# Altium schematic sheet Vesc_Bigfets.SchDoc
size C
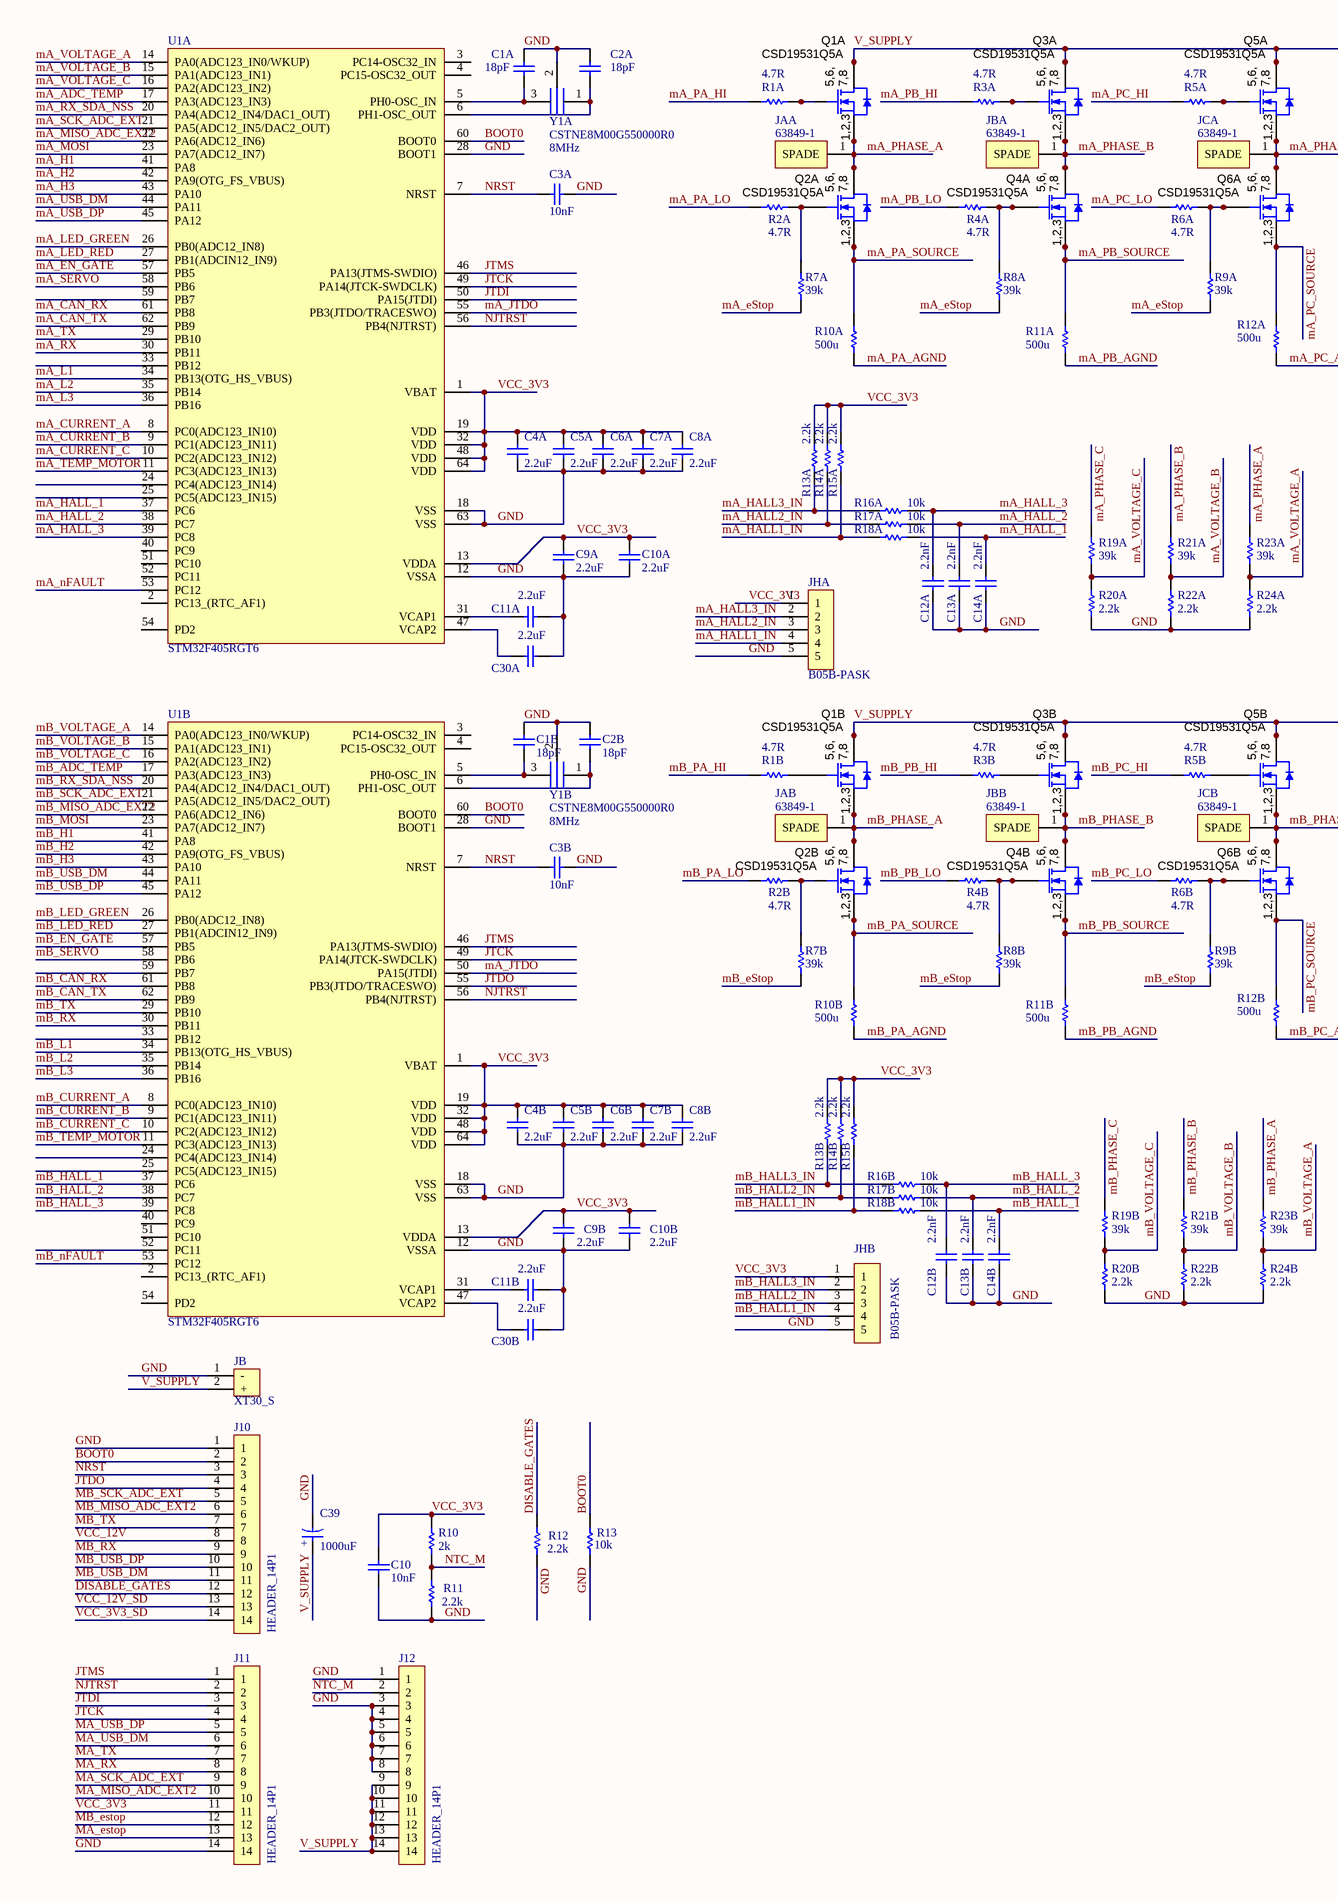
[diagram p0: Vesc_Bigfets.SchDoc, left]
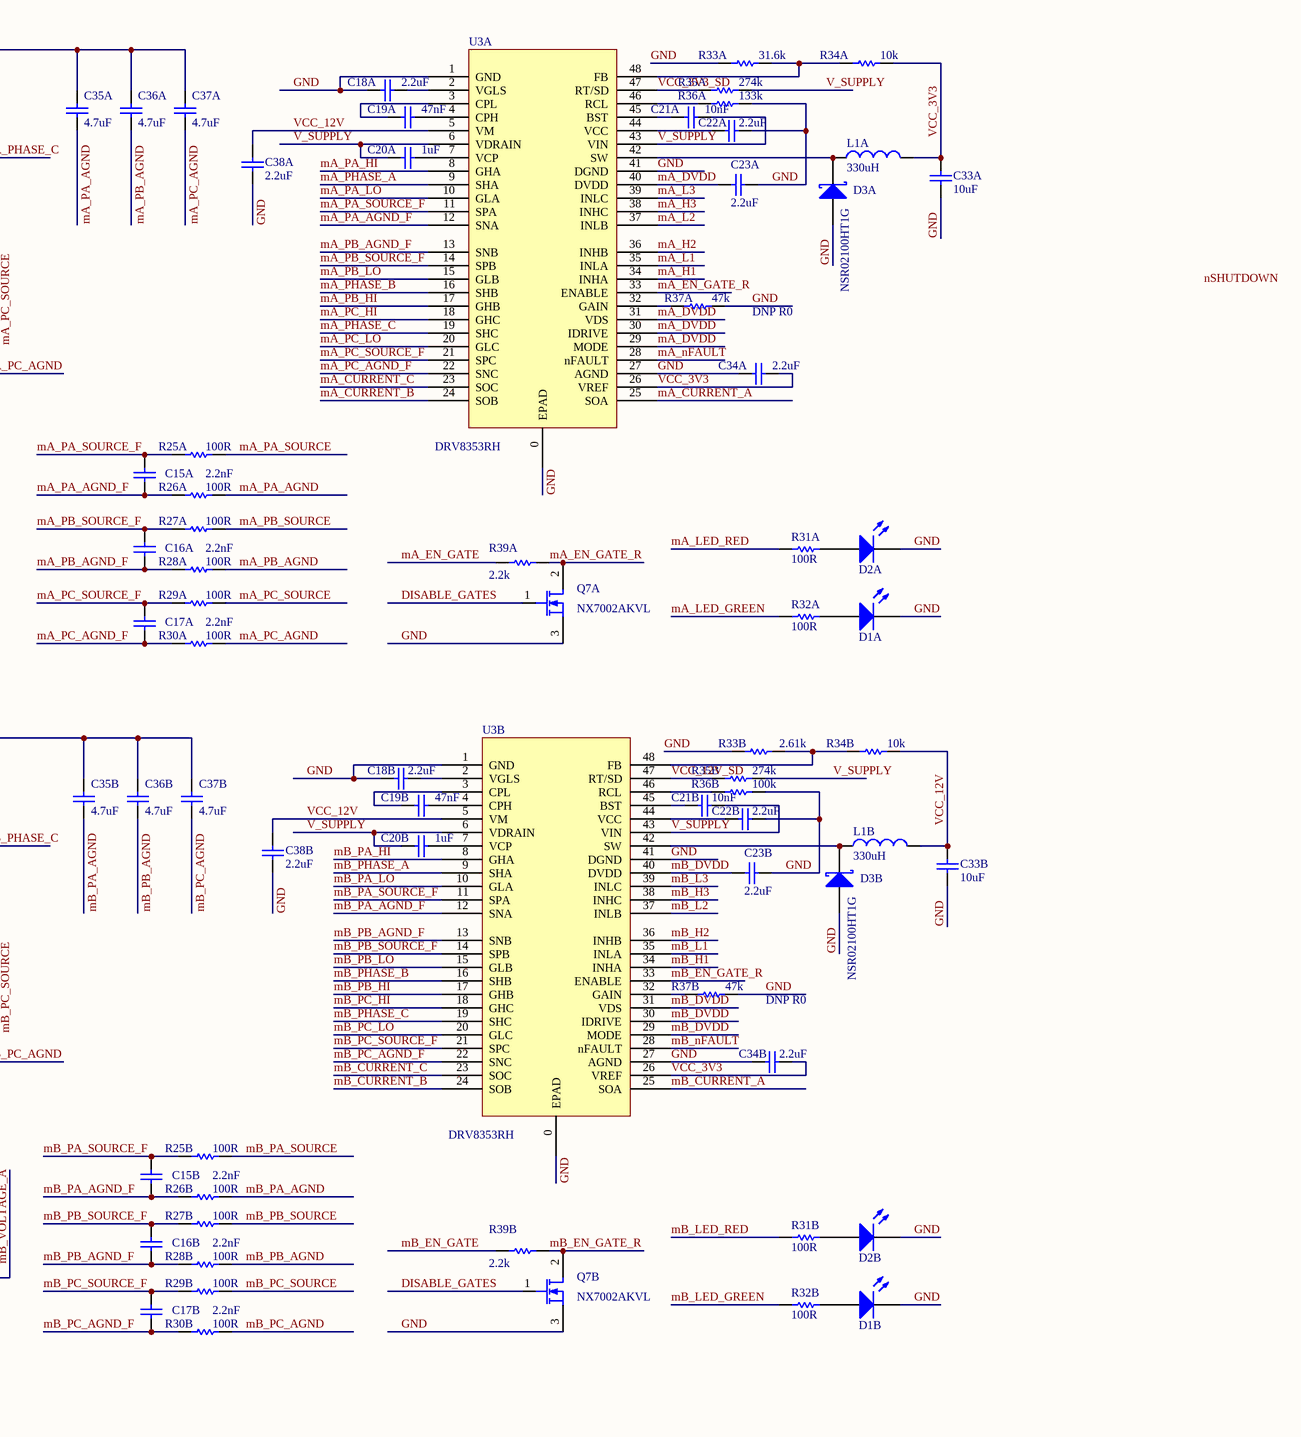
[diagram p1: Vesc_Bigfets.SchDoc, right]

## Parts
C1A  value 18pF  [CAP 0402]  (hidden comment: GCM1555C1H180JA16D)
C1B  value 18pF  [CAP 0402]  (hidden comment: GCM1555C1H180JA16D)
C2A  value 18pF  [CAP 0402]  (hidden comment: GCM1555C1H180JA16D)
C2B  value 18pF  [CAP 0402]  (hidden comment: GCM1555C1H180JA16D)
C3A  value 10nF  [CAP 0402]  (hidden comment: GCM155R71E103JA37D)
C3B  value 10nF  [CAP 0402]  (hidden comment: GCM155R71E103JA37D)
C4A  value 2.2uF  [CAP 0402]  (hidden comment: GRM155C81C225ME15D)
C4B  value 2.2uF  [CAP 0402]  (hidden comment: GRM155C81C225ME15D)
C5A  value 2.2uF  [CAP 0402]  (hidden comment: GRM155C81C225ME15D)
C5B  value 2.2uF  [CAP 0402]  (hidden comment: GRM155C81C225ME15D)
C6A  value 2.2uF  [CAP 0402]  (hidden comment: GRM155C81C225ME15D)
C6B  value 2.2uF  [CAP 0402]  (hidden comment: GRM155C81C225ME15D)
C7A  value 2.2uF  [CAP 0402]  (hidden comment: GRM155C81C225ME15D)
C7B  value 2.2uF  [CAP 0402]  (hidden comment: GRM155C81C225ME15D)
C8A  value 2.2uF  [CAP 0402]  (hidden comment: GRM155C81C225ME15D)
C8B  value 2.2uF  [CAP 0402]  (hidden comment: GRM155C81C225ME15D)
C9A  value 2.2uF  [CAP 0402]  (hidden comment: GRM155C81C225ME15D)
C9B  value 2.2uF  [CAP 0402]  (hidden comment: GRM155C81C225ME15D)
C10  value 10nF  [CAP 0402]  (hidden comment: GCM155R71E103JA37D)
C10A  value 2.2uF  [CAP 0402]  (hidden comment: GRM155C81C225ME15D)
C10B  value 2.2uF  [CAP 0402]  (hidden comment: GRM155C81C225ME15D)
C11A  value 2.2uF  [CAP 0402]  (hidden comment: GRM155C81C225ME15D)
C11B  value 2.2uF  [CAP 0402]  (hidden comment: GRM155C81C225ME15D)
C12A  value 2.2nF  [CAP 0402]  (hidden comment: GCM155R72A222KA37D)
C12B  value 2.2nF  [CAP 0402]  (hidden comment: GCM155R72A222KA37D)
C13A  value 2.2nF  [CAP 0402]  (hidden comment: GCM155R72A222KA37D)
C13B  value 2.2nF  [CAP 0402]  (hidden comment: GCM155R72A222KA37D)
C14A  value 2.2nF  [CAP 0402]  (hidden comment: GCM155R72A222KA37D)
C14B  value 2.2nF  [CAP 0402]  (hidden comment: GCM155R72A222KA37D)
C15A  value 2.2nF  [CAP 0402]  (hidden comment: GCM155R72A222KA37D)
C15B  value 2.2nF  [CAP 0402]  (hidden comment: GCM155R72A222KA37D)
C16A  value 2.2nF  [CAP 0402]  (hidden comment: GCM155R72A222KA37D)
C16B  value 2.2nF  [CAP 0402]  (hidden comment: GCM155R72A222KA37D)
C17A  value 2.2nF  [CAP 0402]  (hidden comment: GCM155R72A222KA37D)
C17B  value 2.2nF  [CAP 0402]  (hidden comment: GCM155R72A222KA37D)
C18A  value 2.2uF  [CAP 0402]  (hidden comment: GRM155C81C225ME15D)
C18B  value 2.2uF  [CAP 0402]  (hidden comment: GRM155C81C225ME15D)
C19A  value 47nF  [CAP 0603]  (hidden comment: C0603C473K1RECAUTO)
C19B  value 47nF  [CAP 0603]  (hidden comment: C0603C473K1RECAUTO)
C20A  value 1uF  [CAP 1206]  (hidden comment: GRJ31CR72A105KE11L)
C20B  value 1uF  [CAP 1206]  (hidden comment: GRJ31CR72A105KE11L)
C21A  value 10nF  [CAP 0402]  (hidden comment: GCM155R71E103JA37D)
C21B  value 10nF  [CAP 0402]  (hidden comment: GCM155R71E103JA37D)
C22A  value 2.2uF  [CAP 0402]  (hidden comment: GRM155C81C225ME15D)
C22B  value 2.2uF  [CAP 0402]  (hidden comment: GRM155C81C225ME15D)
C23A  value 2.2uF  [CAP 0402]  (hidden comment: GRM155C81C225ME15D)
C23B  value 2.2uF  [CAP 0402]  (hidden comment: GRM155C81C225ME15D)
C30A  value 2.2uF  [CAP 0402]  (hidden comment: GRM155C81C225ME15D)
C30B  value 2.2uF  [CAP 0402]  (hidden comment: GRM155C81C225ME15D)
C33A  value 10uF  [CAP 1206]  (hidden comment: TMK316AB7106KL-T)
C33B  value 10uF  [CAP 1206]  (hidden comment: TMK316AB7106KL-T)
C34A  value 2.2uF  [CAP 0402]  (hidden comment: GRM155C81C225ME15D)
C34B  value 2.2uF  [CAP 0402]  (hidden comment: GRM155C81C225ME15D)
C35A  value 4.7uF  [CAP 1210]  (hidden comment: CGA6M3X7S2A475M200AB)
C35B  value 4.7uF  [CAP 1210]  (hidden comment: CGA6M3X7S2A475M200AB)
C36A  value 4.7uF  [CAP 1210]  (hidden comment: CGA6M3X7S2A475M200AB)
C36B  value 4.7uF  [CAP 1210]  (hidden comment: CGA6M3X7S2A475M200AB)
C37A  value 4.7uF  [CAP 1210]  (hidden comment: CGA6M3X7S2A475M200AB)
C37B  value 4.7uF  [CAP 1210]  (hidden comment: CGA6M3X7S2A475M200AB)
C38A  value 2.2uF  [CAP 0402]  (hidden comment: GRM155C81C225ME15D)
C38B  value 2.2uF  [CAP 0402]  (hidden comment: GRM155C81C225ME15D)
C39  value 1000uF  [CAP 7.5mm Bent Reverse]  (hidden comment: 108CKS100MRY)
D1A  LTST-C190KRKT  [LED 0603]  (value not drawn)
D1B  LTST-C190KRKT  [LED 0603]  (value not drawn)
D2A  LTST-C190KRKT  [LED 0603]  (value not drawn)
D2B  LTST-C190KRKT  [LED 0603]  (value not drawn)
D3A  NSR02100HT1G  [SOD-323/SC76]
D3B  NSR02100HT1G  [SOD-323/SC76]
J10  HEADER_14P1  [HEADER_14P1_FEMALE_TH]
J11  HEADER_14P1  [HEADER_14P1_FEMALE_TH]
J12  HEADER_14P1  [HEADER_14P1_FEMALE_TH]
JAA  63849-1  [63849-1]
JAB  63849-1  [63849-1]
JB  XT30_S  [XT30 SOCKET]
JBA  63849-1  [63849-1]
JBB  63849-1  [63849-1]
JCA  63849-1  [63849-1]
JCB  63849-1  [63849-1]
JHA  B05B-PASK  [B05B-PASK]
JHB  B05B-PASK  [B05B-PASK]
L1A  value 330uH  [SDE0805A]  (hidden comment: SDE0805A-331K)
L1B  value 330uH  [SDE0805A]  (hidden comment: SDE0805A-331K)
Q1A  CSD19531Q5A  [VSONP-8]
Q1B  CSD19531Q5A  [VSONP-8]
Q2A  CSD19531Q5A  [VSONP-8]
Q2B  CSD19531Q5A  [VSONP-8]
Q3A  CSD19531Q5A  [VSONP-8]
Q3B  CSD19531Q5A  [VSONP-8]
Q4A  CSD19531Q5A  [VSONP-8]
Q4B  CSD19531Q5A  [VSONP-8]
Q5A  CSD19531Q5A  [VSONP-8]
Q5B  CSD19531Q5A  [VSONP-8]
Q6A  CSD19531Q5A  [VSONP-8]
Q6B  CSD19531Q5A  [VSONP-8]
Q7A  NX7002AKVL  [SOT-23-3]
Q7B  NX7002AKVL  [SOT-23-3]
R1A  value 4.7R  [RES 0402]  (hidden comment: ERJ-PA3J4R7V)
R1B  value 4.7R  [RES 0402]  (hidden comment: ERJ-PA3J4R7V)
R2A  value 4.7R  [RES 0402]  (hidden comment: ERJ-PA3J4R7V)
R2B  value 4.7R  [RES 0402]  (hidden comment: ERJ-PA3J4R7V)
R3A  value 4.7R  [RES 0402]  (hidden comment: ERJ-PA3J4R7V)
R3B  value 4.7R  [RES 0402]  (hidden comment: ERJ-PA3J4R7V)
R4A  value 4.7R  [RES 0402]  (hidden comment: ERJ-PA3J4R7V)
R4B  value 4.7R  [RES 0402]  (hidden comment: ERJ-PA3J4R7V)
R5A  value 4.7R  [RES 0402]  (hidden comment: ERJ-PA3J4R7V)
R5B  value 4.7R  [RES 0402]  (hidden comment: ERJ-PA3J4R7V)
R6A  value 4.7R  [RES 0402]  (hidden comment: ERJ-PA3J4R7V)
R6B  value 4.7R  [RES 0402]  (hidden comment: ERJ-PA3J4R7V)
R7A  value 39k  [RES 0402]  (hidden comment: ERJ-2RKF3902X)
R7B  value 39k  [RES 0402]  (hidden comment: ERJ-2RKF3902X)
R8A  value 39k  [RES 0402]  (hidden comment: ERJ-2RKF3902X)
R8B  value 39k  [RES 0402]  (hidden comment: ERJ-2RKF3902X)
R9A  value 39k  [RES 0402]  (hidden comment: ERJ-2RKF3902X)
R9B  value 39k  [RES 0402]  (hidden comment: ERJ-2RKF3902X)
R10  value 2k  [RES 0402]  (hidden comment: ERT-J0EG202GM)
R10A  value 500u  [RES 2512]  (hidden comment: WSLF2512L5000FEA)
R10B  value 500u  [RES 2512]  (hidden comment: WSLF2512L5000FEA)
R11  value 2.2k  [RES 0402]  (hidden comment: ERJ-2RKF2201X)
R11A  value 500u  [RES 2512]  (hidden comment: WSLF2512L5000FEA)
R11B  value 500u  [RES 2512]  (hidden comment: WSLF2512L5000FEA)
R12  value 2.2k  [RES 0402]  (hidden comment: ERJ-2RKF2201X)
R12A  value 500u  [RES 2512]  (hidden comment: WSLF2512L5000FEA)
R12B  value 500u  [RES 2512]  (hidden comment: WSLF2512L5000FEA)
R13  value 10k  [RES 0402]  (hidden comment: ERJ-2RKF1002X)
R13A  value 2.2k  [RES 0402]  (hidden comment: ERJ-2RKF2201X)
R13B  value 2.2k  [RES 0402]  (hidden comment: ERJ-2RKF2201X)
R14A  value 2.2k  [RES 0402]  (hidden comment: ERJ-2RKF2201X)
R14B  value 2.2k  [RES 0402]  (hidden comment: ERJ-2RKF2201X)
R15A  value 2.2k  [RES 0402]  (hidden comment: ERJ-2RKF2201X)
R15B  value 2.2k  [RES 0402]  (hidden comment: ERJ-2RKF2201X)
R16A  value 10k  [RES 0402]  (hidden comment: ERJ-2RKF1002X)
R16B  value 10k  [RES 0402]  (hidden comment: ERJ-2RKF1002X)
R17A  value 10k  [RES 0402]  (hidden comment: ERJ-2RKF1002X)
R17B  value 10k  [RES 0402]  (hidden comment: ERJ-2RKF1002X)
R18A  value 10k  [RES 0402]  (hidden comment: ERJ-2RKF1002X)
R18B  value 10k  [RES 0402]  (hidden comment: ERJ-2RKF1002X)
R19A  value 39k  [RES 0402]  (hidden comment: ERJ-2RKF3902X)
R19B  value 39k  [RES 0402]  (hidden comment: ERJ-2RKF3902X)
R20A  value 2.2k  [RES 0402]  (hidden comment: ERJ-2RKF2201X)
R20B  value 2.2k  [RES 0402]  (hidden comment: ERJ-2RKF2201X)
R21A  value 39k  [RES 0402]  (hidden comment: ERJ-2RKF3902X)
R21B  value 39k  [RES 0402]  (hidden comment: ERJ-2RKF3902X)
R22A  value 2.2k  [RES 0402]  (hidden comment: ERJ-2RKF2201X)
R22B  value 2.2k  [RES 0402]  (hidden comment: ERJ-2RKF2201X)
R23A  value 39k  [RES 0402]  (hidden comment: ERJ-2RKF3902X)
R23B  value 39k  [RES 0402]  (hidden comment: ERJ-2RKF3902X)
R24A  value 2.2k  [RES 0402]  (hidden comment: ERJ-2RKF2201X)
R24B  value 2.2k  [RES 0402]  (hidden comment: ERJ-2RKF2201X)
R25A  value 100R  [RES 0402]  (hidden comment: ERJ-2RKF1000X)
R25B  value 100R  [RES 0402]  (hidden comment: ERJ-2RKF1000X)
R26A  value 100R  [RES 0402]  (hidden comment: ERJ-2RKF1000X)
R26B  value 100R  [RES 0402]  (hidden comment: ERJ-2RKF1000X)
R27A  value 100R  [RES 0402]  (hidden comment: ERJ-2RKF1000X)
R27B  value 100R  [RES 0402]  (hidden comment: ERJ-2RKF1000X)
R28A  value 100R  [RES 0402]  (hidden comment: ERJ-2RKF1000X)
R28B  value 100R  [RES 0402]  (hidden comment: ERJ-2RKF1000X)
R29A  value 100R  [RES 0402]  (hidden comment: ERJ-2RKF1000X)
R29B  value 100R  [RES 0402]  (hidden comment: ERJ-2RKF1000X)
R30A  value 100R  [RES 0402]  (hidden comment: ERJ-2RKF1000X)
R30B  value 100R  [RES 0402]  (hidden comment: ERJ-2RKF1000X)
R31A  value 100R  [RES 0402]  (hidden comment: ERJ-2RKF1000X)
R31B  value 100R  [RES 0402]  (hidden comment: ERJ-2RKF1000X)
R32A  value 100R  [RES 0402]  (hidden comment: ERJ-2RKF1000X)
R32B  value 100R  [RES 0402]  (hidden comment: ERJ-2RKF1000X)
R33A  value 31.6k  [RES 0402]  (hidden comment: ERJ-2RKF3162X)
R33B  value 2.61k  [RES 0402]  (hidden comment: ERJ-2RKF2611X)
R34A  value 10k  [RES 0402]  (hidden comment: ERJ-2RKF1002X)
R34B  value 10k  [RES 0402]  (hidden comment: ERJ-2RKF1002X)
R35A  value 274k  [RES 0402]  (hidden comment: ERJ-2RKF2743X)
R35B  value 274k  [RES 0402]  (hidden comment: ERJ-2RKF2743X)
R36A  value 133k  [RES 0402]  (hidden comment: ERJ-2RKF1333X)
R36B  value 100k  [RES 0402]  (hidden comment: ERJ-2RKF1003X)
R37A  value 47k  [RES 0402]  (hidden comment: ERJ-2RKF4702X)
R37B  value 47k  [RES 0402]  (hidden comment: ERJ-2RKF4702X)
R39A  value 2.2k  [RES 0402]  (hidden comment: ERJ-2RKF2201X)
R39B  value 2.2k  [RES 0402]  (hidden comment: ERJ-2RKF2201X)
U1A  STM32F405RGT6  [QFP-64 - P0.5MM]
U1B  STM32F405RGT6  [QFP-64 - P0.5MM]
U3A  DRV8353RH  [QFN-48 - P0.5MM]
U3B  DRV8353RH  [QFN-48 - P0.5MM]
Y1A  CSTNE8M00G550000R0  value 8MHz  [MuRata CSTN]
Y1B  CSTNE8M00G550000R0  value 8MHz  [MuRata CSTN]

## Nets
BOOT0: J10.2 R13.2 U1A.60(BOOT0) U1B.60(BOOT0)
DISABLE_GATES: J10.12 Q7A.1(G) Q7B.1(G) R12.2
GND: C1A.2 C1B.2 C2A.2 C2B.2 C3A.2 C3B.2 C4A.2 C4B.2 C5A.2 C5B.2 C6A.2 C6B.2 C7A.2 C7B.2 C8A.2 C8B.2 C9A.2 C9B.2 C10.1 C10A.2 C10B.2 C11A.2 C11B.2 C12A.1 C12B.1 C13A.1 C13B.1 C14A.1 C14B.1 C18A.2 C18B.2 C22A.1 C22B.1 C23A.1 C23B.1 C30A.2 C30B.2 C33A.2 C33B.2 C34A.2 C34B.2 C38A.2 C38B.2 C39.1 D1A.2(K) D1B.2(K) D2A.2(K) D2B.2(K) D3A.1(A) D3B.1(A) J10.1 J11.14 J12.1 J12.3 J12.4 J12.5 J12.6 J12.7 J12.8 JB.1(-) JHA.5 JHB.5 Q7A.3(D) Q7B.3(D) R11.1 R12.1 R13.1 R20A.1 R20B.1 R22A.1 R22B.1 R24A.1 R24B.1 R33A.1 R33B.1 R36A.2 R36B.2 R37A.2 R37B.2 U1A.12(VSSA) U1A.18(VSS) U1A.28(BOOT1) U1A.63(VSS) U1B.12(VSSA) U1B.18(VSS) U1B.28(BOOT1) U1B.63(VSS) U3A.0(EPAD) U3A.1(GND) U3A.27(AGND) U3A.41(DGND) U3B.0(EPAD) U3B.1(GND) U3B.27(AGND) U3B.41(DGND) Y1A.2 Y1B.2
JTCK: J11.4 U1A.49(PA14(JTCK-SWDCLK)) U1B.49(PA14(JTCK-SWDCLK))
JTDI: J11.3 U1A.50(PA15(JTDI))
JTDO: J10.4 U1B.55(PB3(JTDO/TRACESWO))
JTMS: J11.1 U1A.46(PA13(JTMS-SWDIO)) U1B.46(PA13(JTMS-SWDIO))
mA_ADC_TEMP: U1A.17(PA3(ADC123_IN3))
mA_CAN_RX: U1A.61(PB8)
mA_CAN_TX: U1A.62(PB9)
mA_CURRENT_A: U1A.8(PC0(ADC123_IN10)) U3A.25(SOA)
mA_CURRENT_B: U1A.9(PC1(ADC123_IN11)) U3A.24(SOB)
mA_CURRENT_C: U1A.10(PC2(ADC123_IN12)) U3A.23(SOC)
mA_DVDD: C23A.2 U3A.29(MODE) U3A.30(IDRIVE) U3A.31(VDS) U3A.40(DVDD)
mA_EN_GATE: R39A.2 U1A.57(PB5)
mA_EN_GATE_R: Q7A.2(S) R39A.1 U3A.33(ENABLE)
mA_eStop: J11.13 R7A.1 R8A.1 R9A.1
mA_H1: U1A.41(PA8) U3A.34(INHA)
mA_H2: U1A.42(PA9(OTG_FS_VBUS)) U3A.36(INHB)
mA_H3: U1A.43(PA10) U3A.38(INHC)
mA_HALL1_IN: JHA.4 R15A.1 R18A.1
mA_HALL2_IN: JHA.3 R14A.1 R17A.1
mA_HALL3_IN: JHA.2 R13A.1 R16A.1
mA_HALL_1: C14A.2 R18A.2 U1A.37(PC6)
mA_HALL_2: C13A.2 R17A.2 U1A.38(PC7)
mA_HALL_3: C12A.2 R16A.2 U1A.39(PC8)
mA_JTDO: U1A.55(PB3(JTDO/TRACESWO)) U1B.50(PA15(JTDI))
mA_L1: U1A.34(PB13(OTG_HS_VBUS)) U3A.35(INLA)
mA_L2: U1A.35(PB14) U3A.37(INLB)
mA_L3: U1A.36(PB16) U3A.39(INLC)
mA_LED_GREEN: R32A.2 U1A.26(PB0(ADC12_IN8))
mA_LED_RED: R31A.2 U1A.27(PB1(ADCIN12_IN9))
mA_MISO_ADC_EXT2: J11.10 U1A.22(PA6(ADC12_IN6))
mA_MOSI: U1A.23(PA7(ADC12_IN7))
mA_nFAULT: U1A.53(PC12) U3A.28(nFAULT)
mA_PA_AGND: C35A.1 R10A.1 R26A.2
mA_PA_AGND_F: C15A.1 R26A.1 U3A.12(SNA)
mA_PA_HI: R1A.1 U3A.8(GHA)
mA_PA_LO: R2A.1 U3A.10(GLA)
mA_PA_SOURCE: Q2A.1(S) Q2A.2(S) Q2A.3(S) R10A.2 R25A.2
mA_PA_SOURCE_F: C15A.2 R25A.1 U3A.11(SPA)
mA_PB_AGND: C36A.1 R11A.1 R28A.2
mA_PB_AGND_F: C16A.1 R28A.1 U3A.13(SNB)
mA_PB_HI: R3A.1 U3A.17(GHB)
mA_PB_LO: R4A.1 U3A.15(GLB)
mA_PB_SOURCE: Q4A.1(S) Q4A.2(S) Q4A.3(S) R11A.2 R27A.2
mA_PB_SOURCE_F: C16A.2 R27A.1 U3A.14(SPB)
mA_PC_AGND: C37A.1 R12A.1 R30A.2
mA_PC_AGND_F: C17A.1 R30A.1 U3A.22(SNC)
mA_PC_HI: R5A.1 U3A.18(GHC)
mA_PC_LO: R6A.1 U3A.20(GLC)
mA_PC_SOURCE: Q6A.1(S) Q6A.2(S) Q6A.3(S) R12A.2 R29A.2
mA_PC_SOURCE_F: C17A.2 R29A.1 U3A.21(SPC)
mA_PHASE_A: JAA.1(SPADE) Q1A.1(S) Q1A.2(S) Q1A.3(S) Q2A.5(D) Q2A.6(D) Q2A.7(D) Q2A.8(D) Q2A.9(D) R23A.2 U3A.9(SHA)
mA_PHASE_B: JBA.1(SPADE) Q3A.1(S) Q3A.2(S) Q3A.3(S) Q4A.5(D) Q4A.6(D) Q4A.7(D) Q4A.8(D) Q4A.9(D) R21A.2 U3A.16(SHB)
mA_PHASE_C: JCA.1(SPADE) Q5A.1(S) Q5A.2(S) Q5A.3(S) Q6A.5(D) Q6A.6(D) Q6A.7(D) Q6A.8(D) Q6A.9(D) R19A.2 U3A.19(SHC)
mA_RX: J11.8 U1A.30(PB11)
mA_RX_SDA_NSS: U1A.20(PA4(ADC12_IN4/DAC1_OUT))
mA_SCK_ADC_EXT: J11.9 U1A.21(PA5(ADC12_IN5/DAC2_OUT))
mA_SERVO: U1A.58(PB6)
mA_TEMP_MOTOR: U1A.11(PC3(ADC123_IN13))
mA_TX: J11.7 U1A.29(PB10)
mA_USB_DM: J11.6 U1A.44(PA11)
mA_USB_DP: J11.5 U1A.45(PA12)
mA_VOLTAGE_A: R23A.1 R24A.2 U1A.14(PA0(ADC123_IN0/WKUP))
mA_VOLTAGE_B: R21A.1 R22A.2 U1A.15(PA1(ADC123_IN1))
mA_VOLTAGE_C: R19A.1 R20A.2 U1A.16(PA2(ADC123_IN2))
mB_ADC_TEMP: U1B.17(PA3(ADC123_IN3))
mB_CAN_RX: U1B.61(PB8)
mB_CAN_TX: U1B.62(PB9)
mB_CURRENT_A: U1B.8(PC0(ADC123_IN10)) U3B.25(SOA)
mB_CURRENT_B: U1B.9(PC1(ADC123_IN11)) U3B.24(SOB)
mB_CURRENT_C: U1B.10(PC2(ADC123_IN12)) U3B.23(SOC)
mB_DVDD: C23B.2 U3B.29(MODE) U3B.30(IDRIVE) U3B.31(VDS) U3B.40(DVDD)
mB_EN_GATE: R39B.2 U1B.57(PB5)
mB_EN_GATE_R: Q7B.2(S) R39B.1 U3B.33(ENABLE)
mB_eStop: J11.12 R7B.1 R8B.1 R9B.1
mB_H1: U1B.41(PA8) U3B.34(INHA)
mB_H2: U1B.42(PA9(OTG_FS_VBUS)) U3B.36(INHB)
mB_H3: U1B.43(PA10) U3B.38(INHC)
mB_HALL1_IN: JHB.4 R15B.1 R18B.1
mB_HALL2_IN: JHB.3 R14B.1 R17B.1
mB_HALL3_IN: JHB.2 R13B.1 R16B.1
mB_HALL_1: C14B.2 R18B.2 U1B.37(PC6)
mB_HALL_2: C13B.2 R17B.2 U1B.38(PC7)
mB_HALL_3: C12B.2 R16B.2 U1B.39(PC8)
mB_L1: U1B.34(PB13(OTG_HS_VBUS)) U3B.35(INLA)
mB_L2: U1B.35(PB14) U3B.37(INLB)
mB_L3: U1B.36(PB16) U3B.39(INLC)
mB_LED_GREEN: R32B.2 U1B.26(PB0(ADC12_IN8))
mB_LED_RED: R31B.2 U1B.27(PB1(ADCIN12_IN9))
mB_MISO_ADC_EXT2: J10.6 U1B.22(PA6(ADC12_IN6))
mB_MOSI: U1B.23(PA7(ADC12_IN7))
mB_nFAULT: U1B.53(PC12) U3B.28(nFAULT)
mB_PA_AGND: C35B.1 R10B.1 R26B.2
mB_PA_AGND_F: C15B.1 R26B.1 U3B.12(SNA)
mB_PA_HI: R1B.1 U3B.8(GHA)
mB_PA_LO: R2B.1 U3B.10(GLA)
mB_PA_SOURCE: Q2B.1(S) Q2B.2(S) Q2B.3(S) R10B.2 R25B.2
mB_PA_SOURCE_F: C15B.2 R25B.1 U3B.11(SPA)
mB_PB_AGND: C36B.1 R11B.1 R28B.2
mB_PB_AGND_F: C16B.1 R28B.1 U3B.13(SNB)
mB_PB_HI: R3B.1 U3B.17(GHB)
mB_PB_LO: R4B.1 U3B.15(GLB)
mB_PB_SOURCE: Q4B.1(S) Q4B.2(S) Q4B.3(S) R11B.2 R27B.2
mB_PB_SOURCE_F: C16B.2 R27B.1 U3B.14(SPB)
mB_PC_AGND: C37B.1 R12B.1 R30B.2
mB_PC_AGND_F: C17B.1 R30B.1 U3B.22(SNC)
mB_PC_HI: R5B.1 U3B.18(GHC)
mB_PC_LO: R6B.1 U3B.20(GLC)
mB_PC_SOURCE: Q6B.1(S) Q6B.2(S) Q6B.3(S) R12B.2 R29B.2
mB_PC_SOURCE_F: C17B.2 R29B.1 U3B.21(SPC)
mB_PHASE_A: JAB.1(SPADE) Q1B.1(S) Q1B.2(S) Q1B.3(S) Q2B.5(D) Q2B.6(D) Q2B.7(D) Q2B.8(D) Q2B.9(D) R23B.2 U3B.9(SHA)
mB_PHASE_B: JBB.1(SPADE) Q3B.1(S) Q3B.2(S) Q3B.3(S) Q4B.5(D) Q4B.6(D) Q4B.7(D) Q4B.8(D) Q4B.9(D) R21B.2 U3B.16(SHB)
mB_PHASE_C: JCB.1(SPADE) Q5B.1(S) Q5B.2(S) Q5B.3(S) Q6B.5(D) Q6B.6(D) Q6B.7(D) Q6B.8(D) Q6B.9(D) R19B.2 U3B.19(SHC)
mB_RX: J10.9 U1B.30(PB11)
mB_RX_SDA_NSS: U1B.20(PA4(ADC12_IN4/DAC1_OUT))
mB_SCK_ADC_EXT: J10.5 U1B.21(PA5(ADC12_IN5/DAC2_OUT))
mB_SERVO: U1B.58(PB6)
mB_TEMP_MOTOR: U1B.11(PC3(ADC123_IN13))
mB_TX: J10.7 U1B.29(PB10)
mB_USB_DM: J10.11 U1B.44(PA11)
mB_USB_DP: J10.10 U1B.45(PA12)
mB_VOLTAGE_A: R23B.1 R24B.2 U1B.14(PA0(ADC123_IN0/WKUP))
mB_VOLTAGE_B: R21B.1 R22B.2 U1B.15(PA1(ADC123_IN1))
mB_VOLTAGE_C: R19B.1 R20B.2 U1B.16(PA2(ADC123_IN2))
NJTRST: J11.2 U1A.56(PB4(NJTRST)) U1B.56(PB4(NJTRST))
NRST: C3A.1 C3B.1 J10.3 U1A.7(NRST) U1B.7(NRST)
NTC_M: J12.2 R10.1 R11.2
V_SUPPLY: C20A.1 C20B.1 C21A.2 C21B.2 C35A.2 C35B.2 C36A.2 C36B.2 C37A.2 C37B.2 C39.2 J12.9 J12.10 J12.11 J12.12 J12.13 J12.14 JB.2(+) Q1A.5(D) Q1A.6(D) Q1A.7(D) Q1A.8(D) Q1A.9(D) Q1B.5(D) Q1B.6(D) Q1B.7(D) Q1B.8(D) Q1B.9(D) Q3A.5(D) Q3A.6(D) Q3A.7(D) Q3A.8(D) Q3A.9(D) Q3B.5(D) Q3B.6(D) Q3B.7(D) Q3B.8(D) Q3B.9(D) Q5A.5(D) Q5A.6(D) Q5A.7(D) Q5A.8(D) Q5A.9(D) Q5B.5(D) Q5B.6(D) Q5B.7(D) Q5B.8(D) Q5B.9(D) R35A.2 R35B.2 U3A.6(VDRAIN) U3A.43(VIN) U3B.6(VDRAIN) U3B.43(VIN)
VCC_3V3: C4A.1 C4B.1 C5A.1 C5B.1 C6A.1 C6B.1 C7A.1 C7B.1 C8A.1 C8B.1 C9A.1 C9B.1 C10.2 C10A.1 C10B.1 C33A.1 C34A.1 C34B.1 J11.11 JHA.1 JHB.1 L1A.2 R10.2 R13A.2 R13B.2 R14A.2 R14B.2 R15A.2 R15B.2 R34A.2 U1A.1(VBAT) U1A.13(VDDA) U1A.19(VDD) U1A.32(VDD) U1A.48(VDD) U1A.64(VDD) U1B.1(VBAT) U1B.13(VDDA) U1B.19(VDD) U1B.32(VDD) U1B.48(VDD) U1B.64(VDD) U3A.26(VREF) U3B.26(VREF)
VCC_3V3_SD: J10.14 R35A.1 U3A.47(RT/SD)
VCC_12V: C33B.1 C38A.1 C38B.1 J10.8 L1B.2 R34B.2 U3A.5(VM) U3B.5(VM)
VCC_12V_SD: J10.13 R35B.1 U3B.47(RT/SD)
NetC1A_1: C1A.1 U1A.5(PH0-OSC_IN) Y1A.3
NetC1B_1: C1B.1 U1B.5(PH0-OSC_IN) Y1B.3
NetC2A_1: C2A.1 U1A.6(PH1-OSC_OUT) Y1A.1
NetC2B_1: C2B.1 U1B.6(PH1-OSC_OUT) Y1B.1
NetC11A_1: C11A.1 U1A.31(VCAP1)
NetC11B_1: C11B.1 U1B.31(VCAP1)
NetC18A_1: C18A.1 U3A.2(VGLS)
NetC18B_1: C18B.1 U3B.2(VGLS)
NetC19A_1: C19A.1 U3A.3(CPL)
NetC19A_2: C19A.2 U3A.4(CPH)
NetC19B_1: C19B.1 U3B.3(CPL)
NetC19B_2: C19B.2 U3B.4(CPH)
NetC20A_2: C20A.2 U3A.7(VCP)
NetC20B_2: C20B.2 U3B.7(VCP)
NetC21A_1: C21A.1 U3A.45(BST)
NetC21B_1: C21B.1 U3B.45(BST)
NetC22A_2: C22A.2 U3A.44(VCC)
NetC22B_2: C22B.2 U3B.44(VCC)
NetC30A_1: C30A.1 U1A.47(VCAP2)
NetC30B_1: C30B.1 U1B.47(VCAP2)
NetD1A_1: D1A.1(A) R32A.1
NetD1B_1: D1B.1(A) R32B.1
NetD2A_1: D2A.1(A) R31A.1
NetD2B_1: D2B.1(A) R31B.1
NetD3A_2: D3A.2(K) L1A.1 U3A.42(SW)
NetD3B_2: D3B.2(K) L1B.1 U3B.42(SW)
NetQ1A_4: Q1A.4(G) R1A.2
NetQ1B_4: Q1B.4(G) R1B.2
NetQ2A_4: Q2A.4(G) R2A.2 R7A.2
NetQ2B_4: Q2B.4(G) R2B.2 R7B.2
NetQ3A_4: Q3A.4(G) R3A.2
NetQ3B_4: Q3B.4(G) R3B.2
NetQ4A_4: Q4A.4(G) R4A.2 R8A.2
NetQ4B_4: Q4B.4(G) R4B.2 R8B.2
NetQ5A_4: Q5A.4(G) R5A.2
NetQ5B_4: Q5B.4(G) R5B.2
NetQ6A_4: Q6A.4(G) R6A.2 R9A.2
NetQ6B_4: Q6B.4(G) R6B.2 R9B.2
NetR33A_2: R33A.2 R34A.1 U3A.48(FB)
NetR33B_2: R33B.2 R34B.1 U3B.48(FB)
NetR36A_1: R36A.1 U3A.46(RCL)
NetR36B_1: R36B.1 U3B.46(RCL)
NetR37A_1: R37A.1 U3A.32(GAIN)
NetR37B_1: R37B.1 U3B.32(GAIN)

Not connected (* = marked no-connect by the designer): U1A 2(PC13_(RTC_AF1)) 3(PC14-OSC32_IN) 4(PC15-OSC32_OUT) 24(PC4(ADC123_IN14)) 25(PC5(ADC123_IN15)) 33(PB12) 40(PC9) 51(PC10) 52(PC11) 54(PD2) 59(PB7); U1B 2(PC13_(RTC_AF1)) 3(PC14-OSC32_IN) 4(PC15-OSC32_OUT) 24(PC4(ADC123_IN14)) 25(PC5(ADC123_IN15)) 33(PB12) 40(PC9) 51(PC10) 52(PC11) 54(PD2) 59(PB7)

## Notes on the sheet
- DNP R0
- Labels drawn without touching a wire or pin: nSHUTDOWN
- (in symbol 108CKS100MRY) +
- (in symbol CSD19531Q5A) 5,6,; 7,8; 1,2,3

## Library data of the parts
C1A C1B C2A C2B = GCM1555C1H180JA16D: CAP 0402 18pF 50V (NP0 Dielectric); WVDC: 50
C3A C3B C10 C21A C21B = GCM155R71E103JA37D: CAP 0402 10nF 25V; WVDC: 25
C4A C4B C5A C5B C6A C6B C7A C7B C8A C8B C9A C9B C10A C10B C11A C11B C18A C18B C22A C22B C23A C23B C30A C30B C34A C34B C38A C38B = GRM155C81C225ME15D: CAP 0402 2.2uF 16V; WVDC: 16
C12A C12B C13A C13B C14A C14B C15A C15B C16A C16B C17A C17B = GCM155R72A222KA37D: CAP 0402 2.2nF 100V (X7R DIELECTRIC); WVDC: 100
C19A C19B = C0603C473K1RECAUTO: CAP 0603 47nF 100V (X7R DIELECTRIC); WVDC: 100
C20A C20B = GRJ31CR72A105KE11L: CAP 1206 1uF 100V; WVDC: 100
C33A C33B = TMK316AB7106KL-T: CAP 1206 10uF 25V; WVDC: 25
C35A C35B C36A C36B C37A C37B = CGA6M3X7S2A475M200AB: CAP 1206 4.7uF 100V; WVDC: 100
C39 = 108CKS100MRY: CAP 7.5mm Radial 1000uF 100V; WVDC: 100
D1A D1B D2A D2B = LTST-C190KRKT: RED LED
D3A D3B = NSR02100HT1G: Schottky Diodes & Rectifiers 100V; Vrrm: 100; If: 200mA
J10-J12 = HEADER_14P1: 2.54mm Header 14 Pin 1 Row
JAA JAB JBA JBB JCA JCB = 63849-1: SPADE CONNECTOR BOARD MOUNT
JB = XT30_S: XT30 SOCKET
L1A L1B = SDE0805A-331K: Fixed Inductors 330uH 10% SMD 0805 AEC-Q200; Isat: 400mA
Q1A Q1B Q2A Q2B Q3A Q3B Q4A Q4B Q5A Q5B Q6A Q6B = CSD19531Q5A: 100V 100A VSONP-8 5.3mOhm Pwr MOSFET; Manufacturer: Texas Instruments; Value2: 48 nC; QgTyp_nC: 48; SizeAreaWB_mm2: 56; SizeArea_mm2: 30; SizeX_mm: 6; SizeY_mm: 5; SizeZ_mm: 1; PartNumber: CSD19531Q5A; Value: 100V; VdsMax_V: 100V; Vgs_V: 100V; IdsMax_A: 100A; RoHS: Y; ComponentLink1Description: Datasheet link
Q7A Q7B = NX7002AKVL: MOSFET 60V 190mA
R1A R1B R2A R2B R3A R3B R4A R4B R5A R5B R6A R6B = ERJ-PA3J4R7V: RES 0402 4.7R 5%
R7A R7B R8A R8B R9A R9B R19A R19B R21A R21B R23A R23B = ERJ-2RKF3902X: RES 0402 39k 1%
R10 = ERT-J0EG202GM: NTC THERMISTOR 0402 2k 2%
R10A R10B R11A R11B R12A R12B = WSLF2512L5000FEA: RES 2512 0.5mOhm 1%
R11 R12 R13A R13B R14A R14B R15A R15B R20A R20B R22A R22B R24A R24B R39A R39B = ERJ-2RKF2201X: RES 0402 2.2k 1%
R13 R16A R16B R17A R17B R18A R18B R34A R34B = ERJ-2RKF1002X: RES 0402 10k 1%
R25A R25B R26A R26B R27A R27B R28A R28B R29A R29B R30A R30B R31A R31B R32A R32B = ERJ-2RKF1000X: RES 0402 100R 1%
R33A = ERJ-2RKF3162X: RES 0402 31.6k 1%
R33B = ERJ-2RKF2611X: RES 0402 2.61k 1%
R35A R35B = ERJ-2RKF2743X: RES 0402 274k 1%
R36A = ERJ-2RKF1333X: RES 0402 133k 1%
R36B = ERJ-2RKF1003X: RES 0402 100k 1%
R37A R37B = ERJ-2RKF4702X: RES 0402 47k 1%
U1A U1B = STM32F405RGT6: Cortex M4 MCU
U3A U3B = DRV8353RH: 100V Three Phase Gate Driver With 3 Current Shunt Amplifiers and Buck Regulator
Y1A Y1B = CSTNE8M00G550000R0: Ceramic Resonator 8.0000MHz 33pf 0.5%